# EAGLE design SH_HALF_ab_3 (EAGLE 7.3.0)
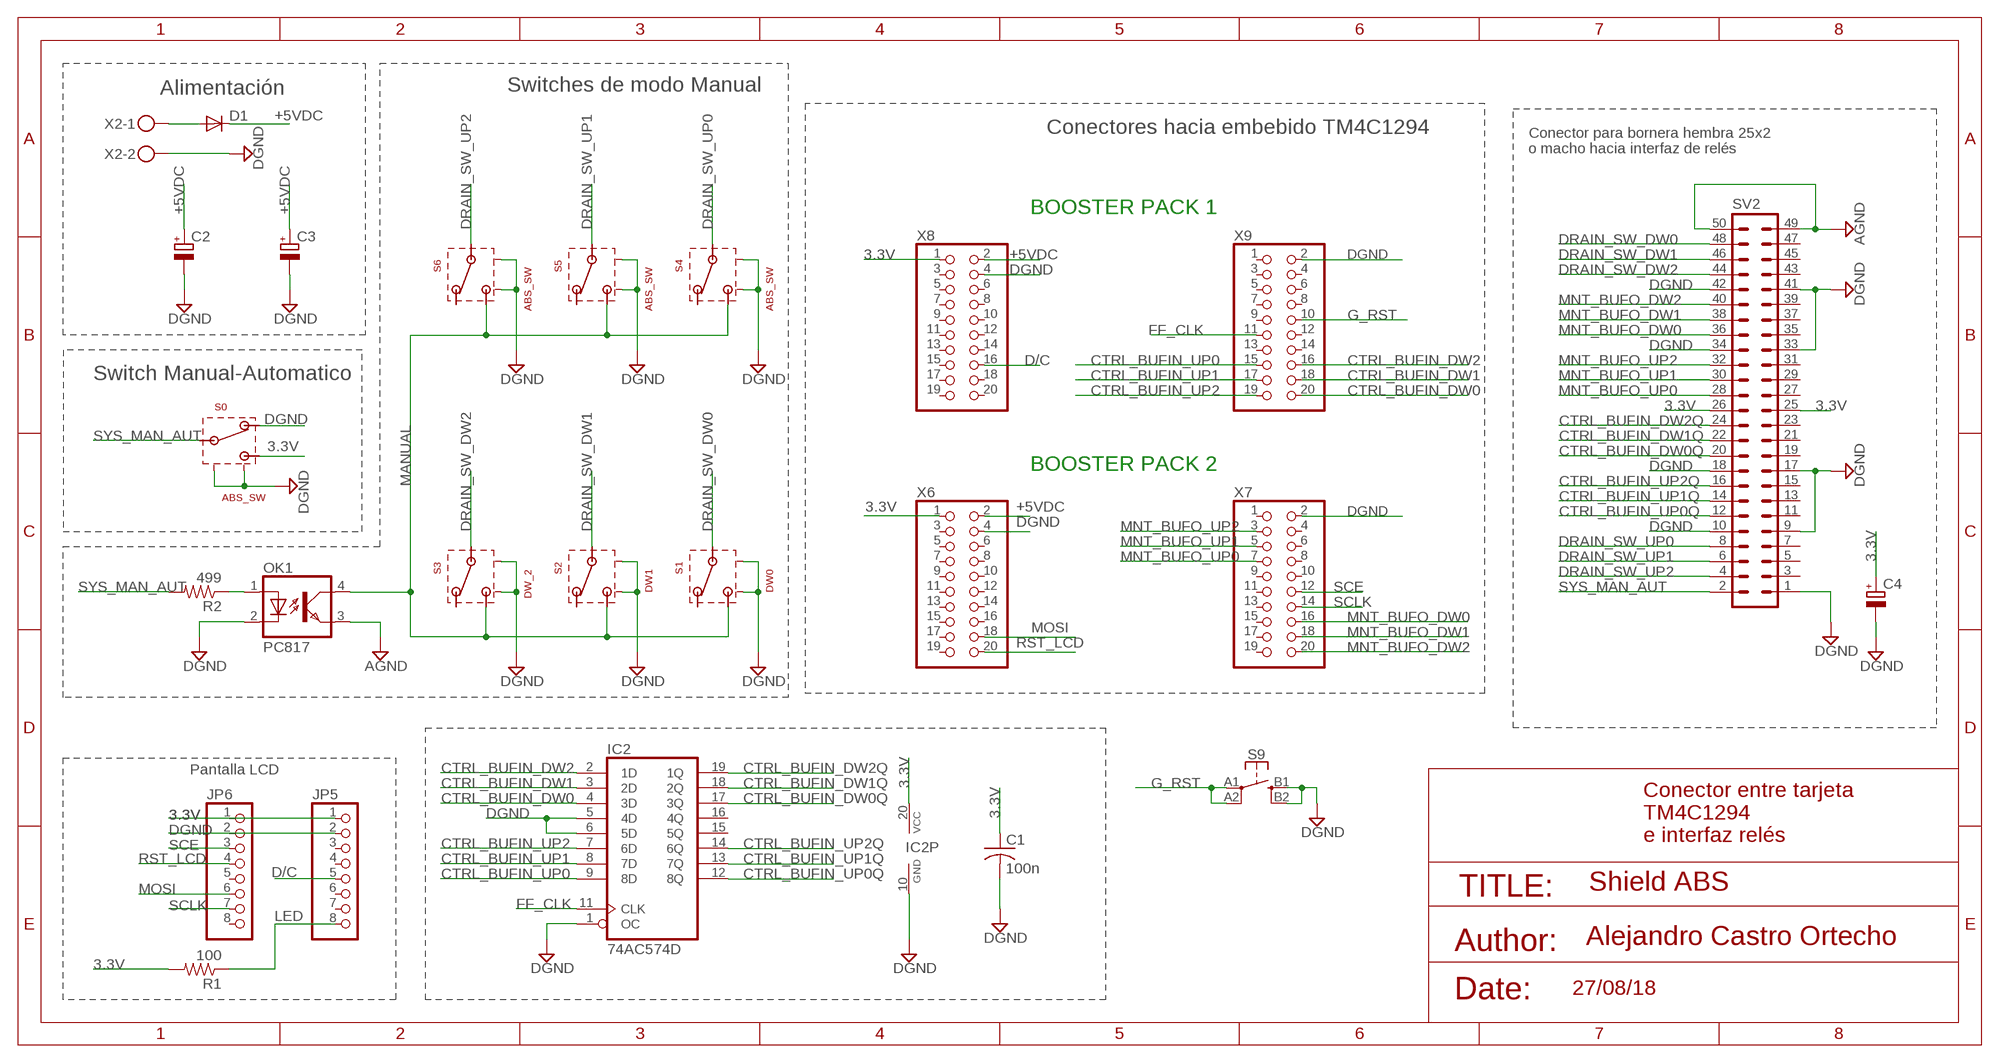
[diagram p0: schematic, sheet 1]

## Parts
C1  100n  C-USC0805K  [C0805K]
C2  CPOL-EUB/3528-21R  [B/3528-21R]
C3  CPOL-EUB/3528-21R  [B/3528-21R]
C4  CPOL-EUB/3528-21R  [B/3528-21R]
D1  DIODE-SMBSMB  [SMB]
IC2  74AC574D  [SO20W]
JP5  PINHD-1X8  [1X08]
JP6  PINHD-1X8  [1X08]
OK1  PC817  [DIL04]
R1  100  R-US_R1206  [R1206]
R2  499  R-US_R1206  [R1206]
S0  ABS_SW  [ABS_SW]
S1  DW0  ABS_SW  [ABS_SW]
S2  DW1  ABS_SW  [ABS_SW]
S3  DW_2  ABS_SW  [ABS_SW]
S4  ABS_SW  [ABS_SW]
S5  ABS_SW  [ABS_SW]
S6  ABS_SW  [ABS_SW]
S9  MOMENTARY-SWITCH-SPST-2  [TACTILE_SWITCH_SMD_6.2MM_TALL]
SV2  ML50F  [ML50_F]
X2  MKDSN1,5/2-5,08  [MKDSN1,5/2-5,08]
X6  PINHD-2X10  [2X10]
X7  PINHD-2X10  [2X10]
X8  PINHD-2X10  [2X10]
X9  PINHD-2X10  [2X10]

## Nets
3.3V: C1.1 C4.+ IC2.20(VCC) JP5.1 JP6.1 R1.2 S0.3 SV2.25 SV2.26 X6.1 X8.1
+5VDC: C2.+ C3.+ D1.C X6.2 X8.2
AGND: OK1.3(EMIT) SV2.49 SV2.50
CTRL_BUFIN_DW0: IC2.4(3D) X9.20
CTRL_BUFIN_DW0Q: IC2.17(3Q) SV2.20
CTRL_BUFIN_DW1: IC2.3(2D) X9.18
CTRL_BUFIN_DW1Q: IC2.18(2Q) SV2.22
CTRL_BUFIN_DW2: IC2.2(1D) X9.16
CTRL_BUFIN_DW2Q: IC2.19(1Q) SV2.24
CTRL_BUFIN_UP0: IC2.9(8D) X9.15
CTRL_BUFIN_UP0Q: IC2.12(8Q) SV2.12
CTRL_BUFIN_UP1: IC2.8(7D) X9.17
CTRL_BUFIN_UP1Q: IC2.13(7Q) SV2.14
CTRL_BUFIN_UP2: IC2.7(6D) X9.19
CTRL_BUFIN_UP2Q: IC2.14(6Q) SV2.16
D/C: JP5.5 X8.16
DGND: C1.2 C2.- C3.- C4.- IC2.1(OC) IC2.5(4D) IC2.6(5D) IC2.10(GND) JP5.2 JP6.2 OK1.2(C) S0.1 S0.M1(GND) S0.M2(GND1) S1.M1(GND) S1.M2(GND1) S2.M1(GND) S2.M2(GND1) S3.M1(GND) S3.M2(GND1) S4.M1(GND) S4.M2(GND1) S5.M1(GND) S5.M2(GND1) S6.M1(GND) S6.M2(GND1) S9.B1 S9.B2 SV2.1 SV2.9 SV2.10 SV2.17 SV2.18 SV2.33 SV2.34 SV2.41 SV2.42 X2.2 X6.4 X7.2 X8.4 X9.2
DRAIN_SW_DW0: S1.2 SV2.48
DRAIN_SW_DW1: S2.2 SV2.46
DRAIN_SW_DW2: S3.2 SV2.44
DRAIN_SW_UP0: S4.2 SV2.8
DRAIN_SW_UP1: S5.2 SV2.6
DRAIN_SW_UP2: S6.2 SV2.4
FF_CLK: IC2.11(CLK) X9.11
G_RST: S9.A1 S9.A2 X9.10
LED: JP5.8 R1.1
MANUAL: OK1.4(COL) S1.3 S2.3 S3.3 S4.3 S5.3 S6.3
MNT_BUFO_DW0: SV2.36 X7.16
MNT_BUFO_DW1: SV2.38 X7.18
MNT_BUFO_DW2: SV2.40 X7.20
MNT_BUFO_UP0: SV2.28 X7.7
MNT_BUFO_UP1: SV2.30 X7.5
MNT_BUFO_UP2: SV2.32 X7.3
MOSI: JP6.6 X6.18
N$1: D1.A X2.1
N$3: OK1.1(A) R2.1
RST_LCD: JP6.4 X6.20
SCE: JP6.3 X7.12
SCLK: JP6.7 X7.14
SYS_MAN_AUT: R2.2 S0.2 SV2.2
Unconnected: IC2.15(5Q) IC2.16(4Q) JP5.3 JP5.4 JP5.6 JP5.7 JP6.5 JP6.8 S1.1 S2.1 S3.1 S4.1 S5.1 S6.1 SV2.3 SV2.5 SV2.7 SV2.11 SV2.13 SV2.15 SV2.19 SV2.21 SV2.23 SV2.27 SV2.29 SV2.31 SV2.35 SV2.37 SV2.39 SV2.43 SV2.45 SV2.47 X6.3 X6.5 X6.6 X6.7 X6.8 X6.9 X6.10 X6.11 X6.12 X6.13 X6.14 X6.15 X6.16 X6.17 X6.19 X7.1 X7.4 X7.6 X7.8 X7.9 X7.10 X7.11 X7.13 X7.15 X7.17 X7.19 X8.3 X8.5 X8.6 X8.7 X8.8 X8.9 X8.10 X8.11 X8.12 X8.13 X8.14 X8.15 X8.17 X8.18 X8.19 X8.20 X9.1 X9.3 X9.4 X9.5 X9.6 X9.7 X9.8 X9.9 X9.12 X9.13 X9.14

## Notes on the sheet
- Alimentación | Switches de modo Manual
- Conectores hacia embebido TM4C1294
- Conector para bornera hembra 25x2
  o macho hacia interfaz de relés
- BOOSTER PACK 1
- Switch Manual-Automatico
- BOOSTER PACK 2
- Pantalla LCD
- Conector entre tarjeta
  TM4C1294
  e interfaz relés
- TITLE: | Shield ABS
- Author: | Alejandro Castro Ortecho
- Date: | 27/08/18

## Library data of the parts
C1 = rcl:C-US: CAPACITOR, American symbol
C2-C4 = rcl:CPOL-EU: POLARIZED CAPACITOR, European symbol
D1 = jicamarca:DIODE-SMB: DIODE; DIGIKEY#: S1AB-FDITR-ND; MANF: Diodes Incorporated; MANF#: S1AB-13-F
IC2 = 74xx-eu:74*574: 8-bit D type FLIP FLOP bus driver
JP5 JP6 = pinhead:PINHD-1X8: PIN HEADER
OK1 = optocoupler:PC817: SHARP OPTO COUPLER; MPN: PC817X4J000F; OC_FARNELL: 9707727; OC_NEWARK: 97K7059
R1 R2 = rcl:R-US_: RESISTOR, American symbol
S0 S1-S6 = switch:ABS_SW
S9 = SparkFun-Switches:MOMENTARY-SWITCH-SPST-2: Momentary Switch (Pushbutton) - SPST - Two Circuits Normally-open (NO) SPST momentary switches (buttons, pushbuttons). Schematic symbol includes two switch circuits. Variants SMD-4.6MMX2.8MM - 4.60mm x 2.80mm Tactile Momentary Button Switch - Used on SparkFun SAMD21 Mini Breakout <https://www.sparkfun.com/products/13664> SMD-5.2MM - Mini Pushbutton Switch - SMD <https://www.sparkfun.com/products/8720> - Used on Arduino Pro Mini <https://www.sparkfun.com/products/11114>
SV2 = con-harting-ml:ML50: HARTING
X2 = con-phoenix-508:MKDSN1,5/2-5,08: MKDSN 1,5/ 2-5,08 Printklemme Nennstrom: 13,5 A Nennspannung: 250 V Rastermaß: 5,08 mm Polzahl: 2 Anschlussart: Schraubanschluss Montage: Löten Anschlussrichtung Leiter/Platine: 0 ° Artikelnummer: 1729128 Source: http://eshop.phoenixcontact.com .. 1729128.pdf
X6-X9 = pinhead:PINHD-2X10: PIN HEADER

## Board
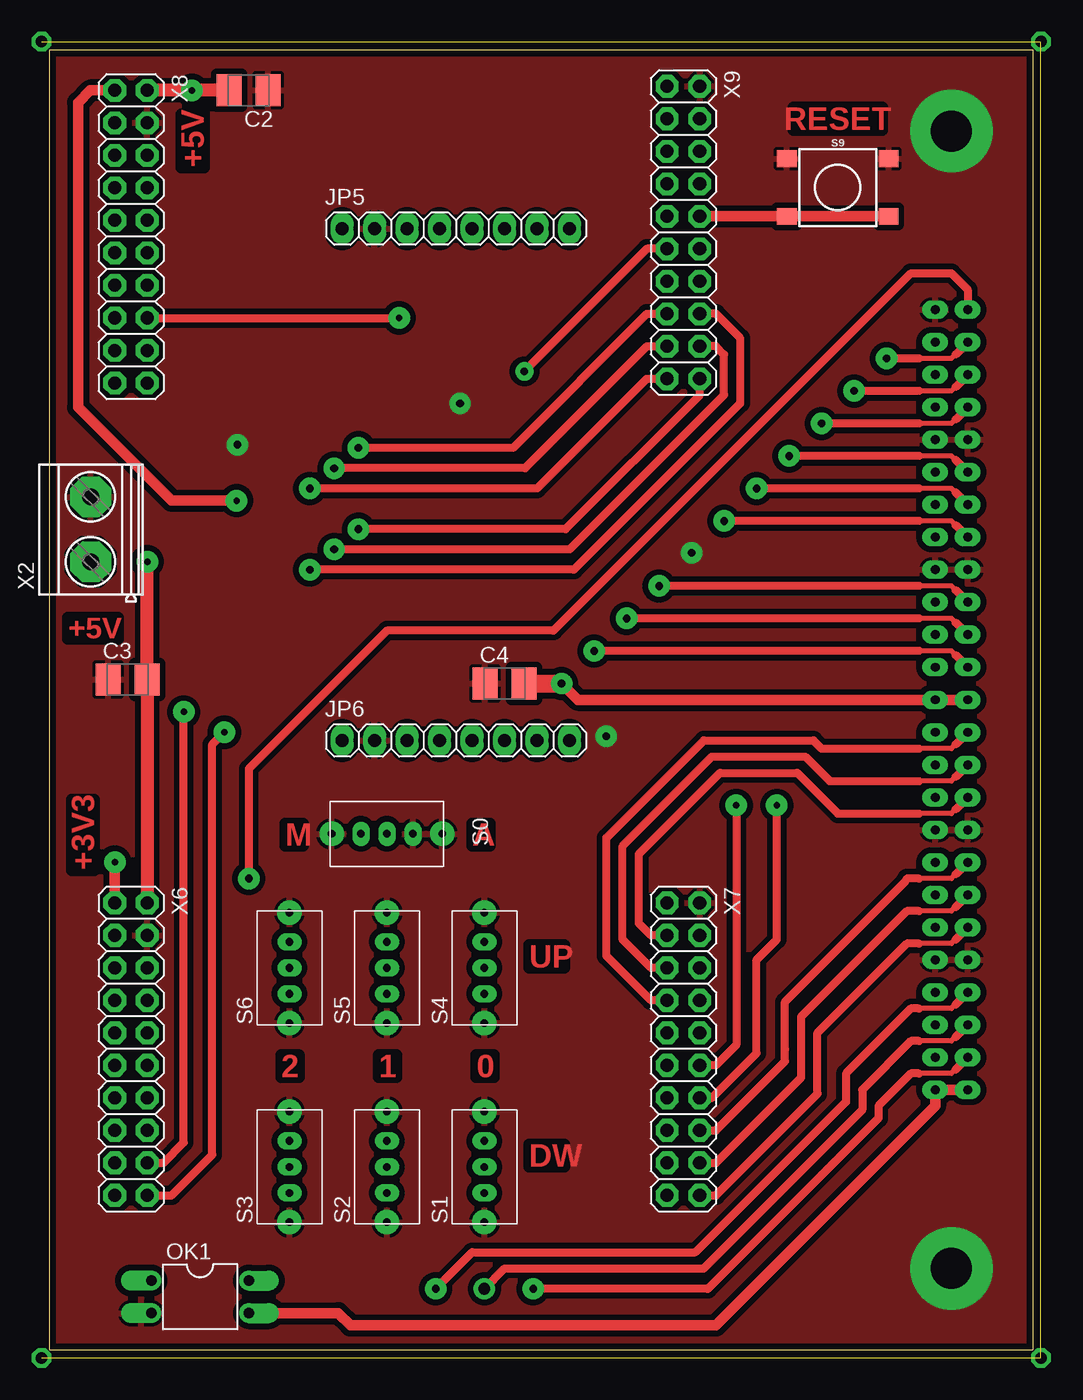
[diagram p1: board, top side]
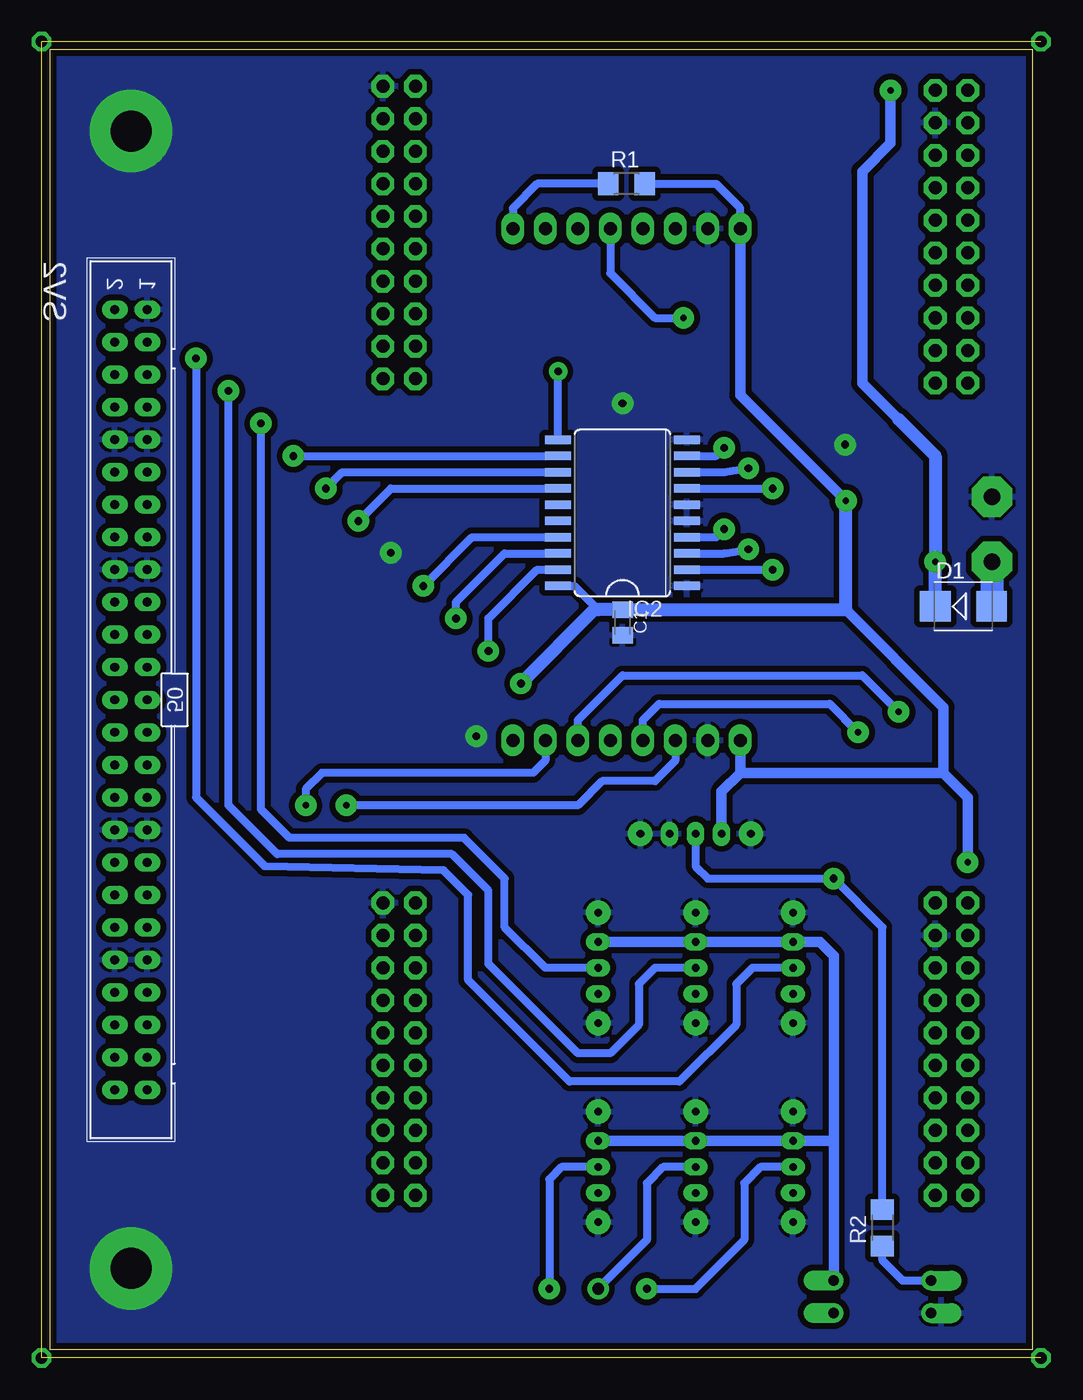
[diagram p2: board, bottom side, seen from below]

Size 76.83 x 101.6 mm. Coordinates in mm from the lower left corner, seen from the top.
Outline: 0,0 0,101.6 76.83,101.6 76.83,0 0,0
Copper layers (1*16): Top 0.035mm / dielectric 1.5mm / Bottom 0.035mm
Design rules "default *": minimum track width 12mil, minimum drill 24mil, track to track 12mil, track to pad 12mil, pad to pad 12mil, via to via 12mil, smd to smd 12mil, copper to edge 20mil, drill to drill 8mil, minimum pad ring 15mil, minimum via ring 12mil, stop-mask expansion 4mil, vias tented up to drill 0mil, thermal gap 10mil

### Footprints (pad centres in the part's own frame; a part is rotated, then mirrored left to right if it is on the bottom)
C0805K = smd 1.3 x 1.6: 1 -1,0; 2 1,0
B/3528-21R = smd 1.95 x 2.5: + 1.525,0; - -1.525,0
SMB = smd 2.4 x 2.4: A 2.2,0; C -2.2,0
SO20W = smd 0.66 x 2.032: 1 -5.715,-5.029; 2 -4.445,-5.029; 3 -3.175,-5.029; 4 -1.905,-5.029; 5 -0.635,-5.029; 6 0.635,-5.029; 7 1.905,-5.029; 8 3.175,-5.029; 9 4.445,-5.029; 10 5.715,-5.029; 11 5.715,5.029; 12 4.445,5.029; 13 3.175,5.029; 14 1.905,5.029; 15 0.635,5.029; 16 -0.635,5.029; 17 -1.905,5.029; 18 -3.175,5.029; 19 -4.445,5.029; 20 -5.715,5.029
1X08 = drill 1.016 long: 1 -8.89,0; 2 -6.35,0; 3 -3.81,0; 4 -1.27,0; 5 1.27,0; 6 3.81,0; 7 6.35,0; 8 8.89,0
DIL04 = drill 0.813 offset: 1 -1.27,-3.81; 2 1.27,-3.81; 3 1.27,3.81; 4 -1.27,3.81
R1206 = smd 1.6 x 1.803: 1 -1.422,0; 2 1.422,0
ABS_SW = drill 0.6 pad 1.27 long: 1 -2.032,0; 2 0,0; 3 2.032,0 | drill 0.6 pad 1.905: M1 -4.318,0; M2 4.318,0
TACTILE_SWITCH_SMD_6.2MM_TALL = smd 1.55 x 1.3: A1 -3.975,-2.25; A2 3.975,-2.25; B1 -3.975,2.25; B2 3.975,2.25
ML50_F = drill 0.7 pad 1.27 long: 1 -30.48,-1.27; 2 -30.48,1.27; 3 -27.94,-1.27; 4 -27.94,1.27; 5 -25.4,-1.27; 6 -25.4,1.27; 7 -22.86,-1.27; 8 -22.86,1.27; 9 -20.32,-1.27; 10 -20.32,1.27; 11 -17.78,-1.27; 12 -17.78,1.27; 13 -15.24,-1.27; 14 -15.24,1.27; 15 -12.7,-1.27; 16 -12.7,1.27; 17 -10.16,-1.27; 18 -10.16,1.27; 19 -7.62,-1.27; 20 -7.62,1.27; 21 -5.08,-1.27; 22 -5.08,1.27; 23 -2.54,-1.27; 24 -2.54,1.27; 25 0,-1.27; 26 0,1.27; 27 2.54,-1.27; 28 2.54,1.27; 29 5.08,-1.27; 30 5.08,1.27; 31 7.62,-1.27; 32 7.62,1.27; 33 10.16,-1.27; 34 10.16,1.27; 35 12.7,-1.27; 36 12.7,1.27; 37 15.24,-1.27; 38 15.24,1.27; 39 17.78,-1.27; 40 17.78,1.27; 41 20.32,-1.27; 42 20.32,1.27; 43 22.86,-1.27; 44 22.86,1.27; 45 25.4,-1.27; 46 25.4,1.27; 47 27.94,-1.27; 48 27.94,1.27; 49 30.48,-1.27; 50 30.48,1.27
MKDSN1,5/2-5,08 = drill 1.3 pad 3.175 octagon: 1 -2.561,0.025; 2 2.519,0.025
2X10 = drill 1.016 octagon: 1 -11.43,-1.27; 2 -11.43,1.27; 3 -8.89,-1.27; 4 -8.89,1.27; 5 -6.35,-1.27; 6 -6.35,1.27; 7 -3.81,-1.27; 8 -3.81,1.27; 9 -1.27,-1.27; 10 -1.27,1.27; 11 1.27,-1.27; 12 1.27,1.27; 13 3.81,-1.27; 14 3.81,1.27; 15 6.35,-1.27; 16 6.35,1.27; 17 8.89,-1.27; 18 8.89,1.27; 19 11.43,-1.27; 20 11.43,1.27

### Placement (x,y rotation side)
C1  32.07,56.83 270 bottom
C2  15.56,98.42 180 top
C3  6.09,52.39 0 top
C4  35.56,52.07 0 top
D1  5.42,58.1 0 bottom
IC2  32.07,65.41 90 bottom
JP5  31.75,87.63 0 top
JP6  31.75,47.62 0 top
OK1  11.75,4.13 270 top
R1  31.75,91.12 0 bottom
R2  11.75,9.53 90 bottom
S0  26.35,40.32 180 top
S1  33.97,14.29 90 top
S2  26.35,14.29 90 top
S3  18.73,14.29 90 top
S4  33.97,29.84 90 top
S5  26.35,29.84 90 top
S6  18.73,29.84 90 top
S9  61.59,90.83 0 top
SV2  70.48,50.8 270 top
X2  3.22,64.14 90 top
X6  6.35,23.5 270 top
X7  49.53,23.5 270 top
X8  6.35,87 270 top
X9  49.53,87.31 270 top

### Tracks (layer width: path | path; a pad name or v marks a point on that pad's centre or on a via)
3.3V  (via drill 0.5 pad 1.68, 0.6 pad 1.68)
  Top 0.813: X6.1 v5.08,38.1 | X8.1 3.17,98.42 2.22,97.47 2.22,73.66 9.53,66.36 v14.61,66.36 | SV2.26 SV2.25 41.27,50.8 v40,52.07
  Top 1.422: C4.+ v40,52.07
  Bottom 0.61: JP5.1 22.86,89.22 24.77,91.12 R1.2 | IC2.20 35.83,59.69 33.97,57.83
  Bottom 0.813: JP6.1 22.86,45.09 | 22.86,45.09 24.32,43.62 S0.3 | 22.86,45.09 6.99,45.09 | v5.08,38.1 5.08,43.18 6.99,45.09 | 6.99,45.09 6.99,50.21 14.61,57.83 | JP5.1 22.86,74.61 v14.61,66.36
  Bottom 1.016: v40,52.07 34.24,57.83 33.97,57.83 C1.1 14.61,57.83 v14.61,66.36
+5VDC  (via drill 0.5 pad 1.68)
  Top 1.016: X8.2 v11.11,98.42 C2.+ | X6.2 C3.+ v7.62,61.59
  Bottom 0.813: v11.11,98.42 11.11,94.3 13.34,92.08 13.34,75.56 10.48,72.71
  Bottom 1.016: D1.C v7.62,61.59 7.62,69.85 10.48,72.71
AGND
  Top 0.813: OK1.3 22.54,2.86 23.49,1.91 52.07,1.91 69.22,19.05 SV2.49 SV2.50
CTRL_BUFIN_DW0  (via drill 0.6 pad 1.68)
  Top 0.61: X9.20 50.8,74.61 40.32,64.14 v24.13,64.14
  Bottom 0.61: IC2.4 24.77,63.5 v24.13,64.14
CTRL_BUFIN_DW0Q  (via drill 0.6 pad 1.68)
  Top 0.406: 70.8,59.37 70.48,59.69 67.94,59.69
  Top 0.61: SV2.20 70.8,59.37 | 67.94,59.69 v47.62,59.69
  Bottom 0.61: IC2.17 43.81,63.5 v47.62,59.69
CTRL_BUFIN_DW1  (via drill 0.6 pad 1.68)
  Top 0.61: X9.18 52.07,78.42 52.7,77.79 52.7,74.61 40.64,62.55 v22.22,62.55
  Bottom 0.61: IC2.3 24.13,62.23 v22.22,62.55
CTRL_BUFIN_DW1Q  (via drill 0.6 pad 1.68)
  Top 0.406: 70.8,56.83 70.48,57.15 67.94,57.15
  Top 0.61: SV2.22 70.8,56.83 | 67.94,57.15 v45.09,57.15
  Bottom 0.61: IC2.18 41.27,62.23 45.09,58.42 v45.09,57.15
CTRL_BUFIN_DW2  (via drill 0.6 pad 1.68)
  Top 0.61: X9.16 52.07,80.96 53.98,79.06 53.98,73.98 40.96,60.96 v20.32,60.96
  Bottom 0.61: IC2.2 v20.32,60.96
CTRL_BUFIN_DW2Q  (via drill 0.6 pad 1.68)
  Top 0.406: 70.8,54.29 70.48,54.61 67.94,54.61
  Top 0.61: SV2.24 70.8,54.29 | 67.94,54.61 v42.55,54.61
  Bottom 0.61: IC2.19 38.73,60.96 42.55,57.15 v42.55,54.61
CTRL_BUFIN_UP0  (via drill 0.6 pad 1.68)
  Top 0.61: X9.15 46.67,80.96 36.2,70.48 v24.13,70.48
  Bottom 0.61: IC2.9 24.77,69.85 v24.13,70.48
CTRL_BUFIN_UP0Q  (via drill 0.6 pad 1.68)
  Top 0.406: 70.8,69.53 70.48,69.85 67.94,69.85
  Top 0.61: SV2.12 70.8,69.53 | 67.94,69.85 v57.78,69.85
  Bottom 0.61: v57.78,69.85 IC2.12
CTRL_BUFIN_UP1  (via drill 0.6 pad 1.68)
  Top 0.61: X9.17 46.67,78.42 37.15,68.9 v22.22,68.9
  Bottom 0.61: IC2.8 24.13,68.58 v22.22,68.9
CTRL_BUFIN_UP1Q  (via drill 0.6 pad 1.68)
  Top 0.406: 70.8,66.99 70.48,67.31 67.94,67.31
  Top 0.61: SV2.14 70.8,66.99 | 67.94,67.31 v55.24,67.31
  Bottom 0.61: IC2.13 53.98,68.58 v55.24,67.31
CTRL_BUFIN_UP2  (via drill 0.6 pad 1.68)
  Top 0.61: X9.19 46.67,75.88 38.1,67.31 v20.32,67.31
  Bottom 0.61: IC2.7 v20.32,67.31
CTRL_BUFIN_UP2Q  (via drill 0.6 pad 1.68)
  Top 0.406: 70.8,64.45 70.48,64.77 67.94,64.77
  Top 0.61: SV2.16 70.8,64.45 | 67.94,64.77 v52.7,64.77
  Bottom 0.61: IC2.14 50.16,67.31 v52.7,64.77
D/C  (via drill 0.5 pad 1.68)
  Top 0.61: X8.16 v27.3,80.64
  Bottom 0.61: JP5.5 33.02,84.14 29.53,80.64 v27.3,80.64
DGND  (via drill 0.6 pad 1.68, 3.2 pad 6.45)
  other vias: 14.67,70.74 70.48,6.35 70.48,95.25 32.07,73.98 43.5,47.94 50.16,62.29
  pour Top (isolate 0.457, rank 2): -3.81,-1.27 -3.81,102.87 78.74,102.87 78.74,-1.27
  pour Bottom (isolate 0.457): -3.17,-0.64 -3.17,102.23 78.11,102.23 78.11,-0.64
DRAIN_SW_DW0  (via drill 0.6 pad 1.68)
  Top 0.406: 70.8,21.91 70.48,21.59 67.94,21.59
  Top 0.61: SV2.48 70.8,21.91 | 67.94,21.59 67.31,21.59 64.77,19.05 64.77,18.1 51.44,4.76 v37.78,4.76
  Bottom 0.61: S1.2 36.83,14.29 37.78,13.34 v37.78,4.76
DRAIN_SW_DW1  (via drill 0.9 pad 1.68)
  Top 0.406: 70.8,24.45 70.48,24.13 67.94,24.13
  Top 0.61: SV2.46 70.8,24.45 | 67.94,24.13 67.31,24.13 63.5,20.32 63.5,18.73 51.12,6.35 35.56,6.35 v33.97,4.76
  Bottom 0.61: S2.2 28.89,14.29 30.16,13.02 30.16,8.57 v33.97,4.76
DRAIN_SW_DW2  (via drill 0.6 pad 1.68)
  Top 0.406: 70.8,26.99 70.48,26.67 67.94,26.67
  Top 0.61: SV2.44 70.8,26.99 | 67.94,26.67 67.31,26.67 62.23,21.59 62.23,19.37 50.48,7.62 33.02,7.62 v30.16,4.76
  Bottom 0.61: S3.2 21.27,14.29 22.54,13.02 22.54,8.57 26.35,4.76 v30.16,4.76
DRAIN_SW_UP0  (via drill 0.6 pad 1.68)
  Top 0.406: 70.8,72.71 70.48,72.39 67.94,72.39
  Top 0.61: SV2.8 70.8,72.71 | 67.94,72.39 v60.32,72.39
  Bottom 0.61: S4.2 38.1,29.84 41.27,33.02 41.27,36.83 44.45,40.01 58.1,40.01 60.32,42.23 v60.32,72.39
DRAIN_SW_UP1  (via drill 0.6 pad 1.68)
  Top 0.406: 70.8,75.25 70.48,74.93 67.94,74.93
  Top 0.61: SV2.6 70.8,75.25 | 67.94,74.93 v62.86,74.93
  Bottom 0.61: S5.2 29.53,29.84 30.8,28.57 30.8,25.4 33.02,23.18 35.56,23.18 42.55,30.16 42.55,35.88 45.4,38.73 59.05,38.73 62.86,42.55 v62.86,74.93
DRAIN_SW_UP2  (via drill 0.6 pad 1.68)
  Top 0.406: 70.8,77.79 70.48,77.47 67.94,77.47
  Top 0.61: SV2.4 70.8,77.79 | 67.94,77.47 v65.41,77.47
  Bottom 0.61: S6.2 21.91,29.84 23.18,28.57 23.18,25.4 27.62,20.95 36.2,20.95 44.13,28.89 44.13,35.56 46.04,37.47 60.01,37.78 65.41,43.18 v65.41,77.47
FF_CLK  (via drill 0.6 pad 1.42)
  Top 0.61: X9.11 46.67,86.04 v37.1,76.47
  Bottom 0.61: IC2.11 v37.1,76.47
G_RST
  Top 0.813: X9.10 S9.A1 S9.A2
LED
  Bottom 0.61: R1.1 38.73,91.12 40.64,89.22 JP5.8
MANUAL
  Bottom 0.813: 15.56,16.32 S3.3 S2.3 S1.3 | 15.56,16.32 15.56,30.8 16.64,31.88 S6.3 S5.3 S4.3 | OK1.4 15.56,16.32
MNT_BUFO_DW0
  Top 0.406: 70.8,37.15 70.48,36.83 67.94,36.83
  Top 0.61: SV2.36 70.8,37.15 | 67.94,36.83 66.99,36.83 66.8,36.54 57.47,27.2 57.47,23.5 57.47,22.54 52.07,17.14 X7.16
MNT_BUFO_DW1
  Top 0.406: 70.8,34.61 70.48,34.29 67.94,34.29
  Top 0.61: SV2.38 70.8,34.61 | 67.94,34.29 66.99,34.29 58.74,26.04 58.74,21.27 52.07,14.61 X7.18
MNT_BUFO_DW2
  Top 0.406: 70.8,32.07 70.48,31.75 67.94,31.75
  Top 0.61: SV2.40 70.8,32.07 | 67.94,31.75 66.99,31.75 60.01,24.77 60.01,20 52.07,12.06 X7.20
MNT_BUFO_UP0
  Top 0.406: 70.8,47.31 70.48,46.99 67.94,46.99
  Top 0.61: SV2.28 70.8,47.31 | X7.7 46.99,27.3 43.5,30.8 43.5,40.01 51.12,47.62 59.69,47.62 60.32,46.99 67.94,46.99
MNT_BUFO_UP1
  Top 0.406: 70.8,44.77 70.48,44.45 67.94,44.45
  Top 0.61: SV2.30 70.8,44.77 | X7.5 46.99,29.84 44.77,32.07 44.77,39.37 51.75,46.35 59.05,46.35 60.96,44.45 67.94,44.45
MNT_BUFO_UP2
  Top 0.406: 70.8,42.23 70.48,41.91 67.94,41.91
  Top 0.61: SV2.32 70.8,42.23 | X7.3 46.99,32.38 46.04,33.34 46.04,38.73 52.39,45.09 58.42,45.09 61.59,41.91 67.94,41.91
MOSI  (via drill 0.5 pad 1.68)
  Top 0.61: X6.18 8.89,14.61 10.48,16.19 v10.48,49.85
  Bottom 0.61: JP6.6 35.56,49.21 32.07,52.7 13.34,52.7 v10.48,49.85
N$1
  Bottom 1.778: X2.1 3.22,61.57 D1.A
N$3
  Bottom 0.61: OK1.1 10.16,5.4 11.75,6.99 R2.1
N$34  (via drill 0.9)  (3 unrouted)
  other vias: 77.47,-0.64 77.47,102.23 -0.64,102.23 -0.64,-0.64
RST_LCD  (via drill 0.5 pad 1.68)
  Top 0.61: X6.20 9.53,12.06 12.7,15.24 12.7,47.31 v13.65,48.26
  Bottom 0.61: JP6.4 30.48,49.21 29.21,50.48 15.88,50.48 v13.65,48.26
SCE  (via drill 0.5 pad 1.68)
  Top 0.61: X7.12 52.07,22.23 53.66,23.81 v53.66,42.55
  Bottom 0.61: JP6.3 27.94,46.04 29.53,44.45 33.66,44.45 35.56,42.55 v53.66,42.55
SCLK  (via drill 0.5 pad 1.68)
  Top 0.61: X7.14 51.75,19.68 55.24,23.18 55.24,30.48 56.83,32.07 v56.83,42.55
  Bottom 0.61: JP6.7 38.1,46.04 39.05,45.09 55.56,45.09 56.83,43.81 v56.83,42.55
SYS_MAN_AUT  (via drill 0.6 pad 1.68)
  Top 0.61: SV2.2 71.75,82.87 70.48,84.14 67.31,84.14 39.37,56.2 26.35,56.2 15.56,45.4 v15.56,36.83
  Bottom 0.61: S0.2 26.35,37.78 25.4,36.83 v15.56,36.83 11.75,33.02 R2.2

### Text on the board
Top: RESET | +5V | +5V | M | A | +3V3 | UP | 2 | 1 | 0 | DW
Document: GLCD
Reference: Tarjeta de Control Relés | Embebido TM4C1294 | RJ45 | Embebido TM4C1294